# EAGLE design hrd_S2 (EAGLE 7.3.0)
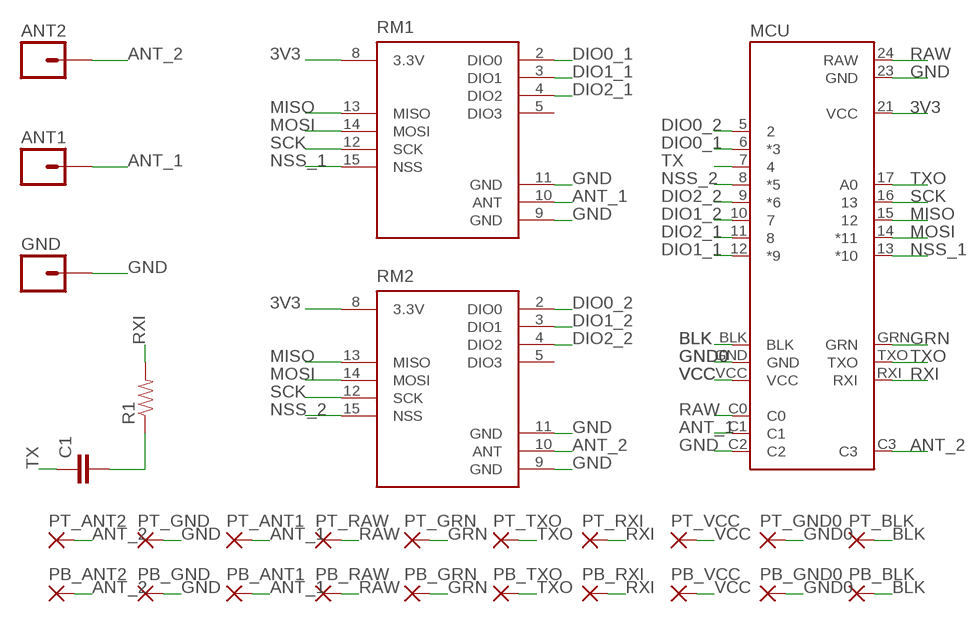
[diagram p0: schematic, sheet 1]

## Parts
ANT1  M01PTH  [1X01]
ANT2  M01PTH  [1X01]
C1  CAP0805  [0805]
GND  M01PTH  [1X01]
MCU  APM  [APM]
PB_ANT1  SMD2  [SMDSLOT]
PB_ANT2  SMD2  [SMDSLOT]
PB_BLK  SMD2  [SMDSLOT]
PB_GND  SMD2  [SMDSLOT]
PB_GND0  SMD2  [SMDSLOT]
PB_GRN  SMD2  [SMDSLOT]
PB_RAW  SMD2  [SMDSLOT]
PB_RXI  SMD2  [SMDSLOT]
PB_TXO  SMD2  [SMDSLOT]
PB_VCC  SMD2  [SMDSLOT]
PT_ANT1  SMD2  [SMDSLOT]
PT_ANT2  SMD2  [SMDSLOT]
PT_BLK  SMD2  [SMDSLOT]
PT_GND  SMD2  [SMDSLOT]
PT_GND0  SMD2  [SMDSLOT]
PT_GRN  SMD2  [SMDSLOT]
PT_RAW  SMD2  [SMDSLOT]
PT_RXI  SMD2  [SMDSLOT]
PT_TXO  SMD2  [SMDSLOT]
PT_VCC  SMD2  [SMDSLOT]
R1  RESISTOR0805-RES  [0805]
RM1  RFM69HW  [RFM69W-XXXS2]
RM2  RFM69HW  [RFM69W-XXXS2]

## Nets
3V3: MCU.21(VCC) RM1.8(3.3V) RM2.8(3.3V)
ANT_1: ANT1.1 MCU.C1 PB_ANT1.1(P) PT_ANT1.1(P) RM1.10(ANT)
ANT_2: ANT2.1 MCU.C3 PB_ANT2.1(P) PT_ANT2.1(P) RM2.10(ANT)
BLK: MCU.BLK PB_BLK.1(P) PT_BLK.1(P)
DIO0_1: MCU.6(*3) RM1.2(DIO0)
DIO0_2: MCU.5 RM2.2(DIO0)
DIO1_1: MCU.12(*9) RM1.3(DIO1)
DIO1_2: MCU.10 RM2.3(DIO1)
DIO2_1: MCU.11 RM1.4(DIO2)
DIO2_2: MCU.9(*6) RM2.4(DIO2)
GND: GND.1 MCU.23(GND) MCU.C2 PB_GND.1(P) PT_GND.1(P) RM1.9(GND) RM1.11(GND) RM2.9(GND) RM2.11(GND)
GND0: MCU.GND PB_GND0.1(P) PT_GND0.1(P)
GRN: MCU.GRN PB_GRN.1(P) PT_GRN.1(P)
MISO: MCU.15 RM1.13(MISO) RM2.13(MISO)
MOSI: MCU.14(*11) RM1.14(MOSI) RM2.14(MOSI)
N$1: C1.2 R1.1
NSS_1: MCU.13(*10) RM1.15(NSS)
NSS_2: MCU.8(*5) RM2.15(NSS)
RAW: MCU.24(RAW) MCU.C0 PB_RAW.1(P) PT_RAW.1(P)
RXI: MCU.RXI PB_RXI.1(P) PT_RXI.1(P) R1.2
SCK: MCU.16 RM1.12(SCK) RM2.12(SCK)
TX: C1.1 MCU.7
TXO: MCU.17(A0) MCU.TXO PB_TXO.1(P) PT_TXO.1(P)
VCC: MCU.VCC PB_VCC.1(P) PT_VCC.1(P)
Unconnected: RM1.5(DIO3) RM2.5(DIO3)

## Library data of the parts
ANT1 ANT2 GND = SparkFun-Connectors:M01: Header 1 Standard 1-pin 0.1" header. Use with straight break away headers (SKU : PRT-00116), right angle break away headers (PRT-00553), swiss pins (PRT-00743), machine pins (PRT-00117), and female headers (PRT-00115).
C1 = SparkFun-Capacitors:CAP: Capacitor Standard 0603 ceramic capacitor, and 0.1" leaded capacitor.
MCU = SparkFun-Boards:APM
PB_ANT1 PB_ANT2 PB_BLK PB_GND PB_GND0 PB_GRN PB_RAW PB_RXI PB_TXO PB_VCC PT_ANT1 PT_ANT2 PT_BLK PT_GND PT_GND0 PT_GRN PT_RAW PT_RXI PT_TXO PT_VCC = wirepad:SMD2: SMD PAD
R1 = SparkFun-Resistors:RESISTOR: Resistor Basic schematic elements and footprints for 0603, 1206, and PTH resistors.
RM1 RM2 = SparkFun-RF:RFM69H

## Net classes
0 default: clearance 0.205 mm

## Board
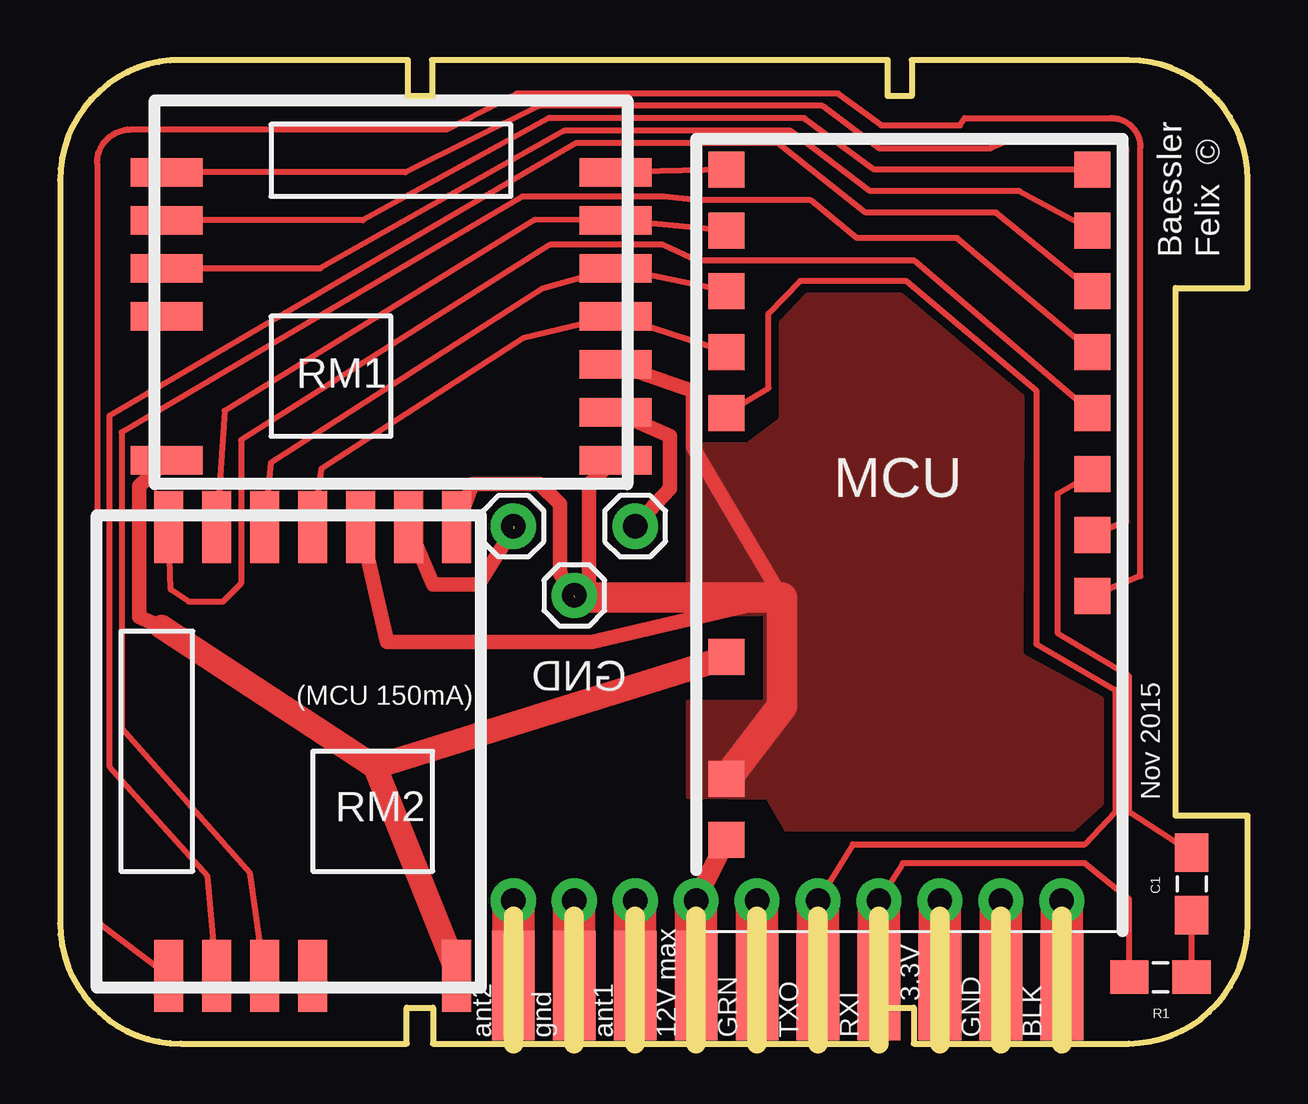
[diagram p1: board, top side]
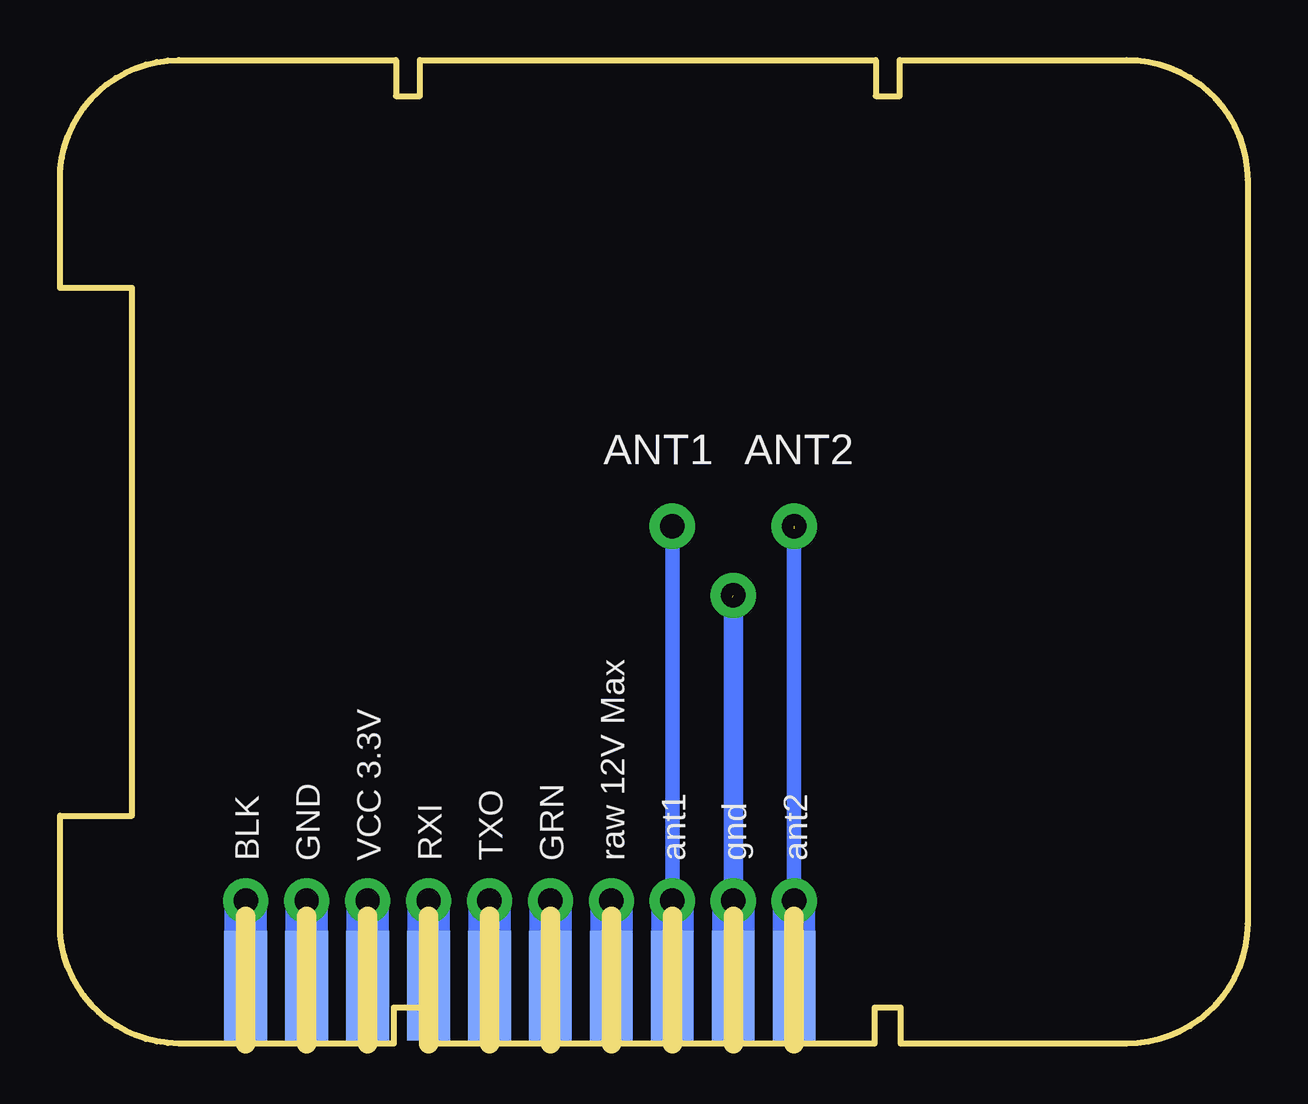
[diagram p2: board, bottom side, seen from below]

Size 49.5 x 41 mm. Coordinates in mm from the lower left corner, seen from the top.
Outline: 18.9,0 15.54,0 15.54,1.5 14.45,1.5 14.45,0 5.05,0 arc-90 0,5 0,36 arc-90 5.05,41 14.5,41 14.5,39.5 15.5,39.5 15.5,41 34.5,41 34.5,39.5 35.5,39.5 35.5,41 44.55,41 arc-90 49.5,36 49.5,31.5 46.5,31.5 46.5,9.5 49.5,9.5 49.5,5 arc-90 44.55,0 41.76,0
Outline: 18.9,0 21.44,0
Outline: 21.44,0 23.98,0
Outline: 23.98,0 26.52,0
Outline: 26.52,0 29.06,0
Outline: 29.06,0 31.6,0
Outline: 31.6,0 34.14,0 34.14,1.5
Outline: 34.14,1.5 35.58,1.5 35.58,0 36.68,0
Outline: 36.68,0 39.22,0
Outline: 39.22,0 41.76,0
Outline: 41.76,0 41.76,5.3
Outline: 39.22,0 39.22,5.3
Outline: 36.68,0 36.68,5.3
Outline: 34.14,1.5 34.14,5.3
Outline: 31.6,0 31.6,5.3
Outline: 29.06,0 29.06,5.3
Outline: 26.52,0 26.52,5.3
Outline: 23.98,0 23.98,5.3
Outline: 21.44,0 21.44,5.3
Outline: 18.9,0 18.9,5.3
Copper layers (1*16): Top 0.035mm / dielectric 1.5mm / Bottom 0.035mm
Design rules "ITEADstudio_DRC": minimum track width 6mil, minimum drill 12mil, track to track 6mil, track to pad 6mil, pad to pad 6mil, via to via 6mil, smd to smd 0mil, copper to edge 10mil, drill to drill 10mil, minimum pad ring 10mil, minimum via ring 6mil, stop-mask expansion 2mil, vias tented up to drill 100mil, thermal gap 10mil

### Footprints (pad centres in the part's own frame; a part is rotated, then mirrored left to right if it is on the bottom)
1X01 = drill 1.016 pad 1.88: 1 0,0
0805 = smd 1.6 x 1.4: 1 -1.3,0; 2 1.3,0
APM = smd 1.5 x 1.5: 5 -7.62,2.54; 6 -7.62,0; 7 -7.62,-2.54; 8 -7.62,-5.08; 9 -7.62,-7.62; 10 -7.62,-10.16; 11 -7.62,-12.7; 12 -7.62,-15.24; 13 7.62,-15.24; 14 7.62,-12.7; 15 7.62,-10.16; 16 7.62,-7.62; 17 7.62,-5.08; 21 7.62,5.08; 23 7.62,10.16; 24 7.62,12.7 | drill 1.016 pad 1.88: BLK -6.35,15.24; C0 8.89,15.24; C1 11.43,15.24; C2 13.97,15.24; C3 16.51,15.24; GND -3.81,15.24; GRN 6.35,15.24; RXI 1.27,15.24; TXO 3.81,15.24; VCC -1.27,15.24
SMDSLOT = smd 1.778 x 4.572: 1 0,0
RFM69W-XXXS2 = smd 3 x 1.2: 2 -9.35,5; 3 -9.35,3; 4 -9.35,1; 5 -9.35,-1; 8 -9.35,-7; 9 9.35,-7; 10 9.35,-5; 11 9.35,-3; 12 9.35,-1; 13 9.35,1; 14 9.35,3; 15 9.35,5

### Placement (x,y rotation side)
ANT1  23.98,21.56 0 top
ANT2  18.9,21.56 0 top
C1  47.17,6.65 270 top
GND  21.44,18.68 0 top
MCU  35.41,21.2 180 top
PB_ANT1  23.98,2.41 0 bottom
PB_ANT2  18.9,2.41 0 bottom
PB_BLK  41.76,2.41 0 bottom
PB_GND  21.44,2.41 0 bottom
PB_GND0  39.22,2.41 0 bottom
PB_GRN  29.06,2.41 0 bottom
PB_RAW  26.52,2.41 0 bottom
PB_RXI  34.14,2.41 0 bottom
PB_TXO  31.6,2.41 0 bottom
PB_VCC  36.68,2.41 0 bottom
PT_ANT1  23.98,2.41 0 top
PT_ANT2  18.9,2.41 0 top
PT_BLK  41.76,2.41 0 top
PT_GND  21.44,2.41 0 top
PT_GND0  39.22,2.41 0 top
PT_GRN  29.06,2.41 0 top
PT_RAW  26.52,2.41 0 top
PT_RXI  34.14,2.41 0 top
PT_TXO  31.6,2.41 0 top
PT_VCC  36.68,2.41 0 top
R1  45.87,2.77 180 top
RM1  13.8,31.32 0 top
RM2  9.54,12.18 90 top

### Tracks (layer width: path | path; a pad name or v marks a point on that pad's centre or on a via)
3V3
  Top 0.61: RM1.8 3.3,23.24 3.3,17.78 4.24,17.37
  Top 0.813: MCU.21 arc-90 27.78,16.1 | RM2.8 arc90 16.59,2.88
  Top 1.016: 13.13,11.53 4.24,17.37 | 16.59,2.88 13.13,11.53 | 27.78,16.1 13.13,11.53
ANT_1
  Top 0.61: ANT1.1 25.43,23.14 25.43,25.32 RM1.10
  Top 1.778: MCU.C1 PB_ANT1.1
  Bottom 0.61: ANT1.1 MCU.C1
  Bottom 1.778: PB_ANT1.1 MCU.C1
ANT_2  (1 unrouted)
  Top 0.61: RM2.10 15.54,19.13 17.45,19.13 18.9,21.46
  Top 1.778: MCU.C3 PB_ANT2.1
  Bottom 0.61: MCU.C3 ANT2.1
  Bottom 1.778: PB_ANT2.1 MCU.C3
BLK
  Top 1.778: MCU.BLK PB_BLK.1
  Bottom 1.778: PB_BLK.1 MCU.BLK
DIO0_1
  Top 0.254: RM1.2 14.4,36.31 19.99,39.09 31.78,39.09 34.14,37.31 38.78,37.31 39.83,37.77 43.81,37.77 arc-90 44.45,37.24 44.45,21.77 MCU.6
DIO0_2
  Top 0.254: RM2.2 1.55,5.08 1.55,36.7 arc-90 2.95,38.1 16.13,38.1 19.05,39.6 32.43,39.6 34.24,38.28 37.52,38.28 37.72,38.58 43.81,38.58 arc-90 45.03,37.36 45.03,19.48 MCU.5
DIO1_1
  Top 0.254: MCU.12 33.93,36.44 31.01,38.58 20.37,38.58 12.62,34.31 RM1.3
DIO1_2
  Top 0.254: RM2.3 6.15,6.99 2.06,11.56 2.06,26.16 21.51,37.54 29.92,37.54 33.58,34.65 39.01,34.65 MCU.10
DIO2_1
  Top 0.254: RM1.4 10.85,32.31 21,38.05 30.45,38.05 33.76,35.53 39.98,35.53 MCU.11
DIO2_2
  Top 0.254: RM2.4 7.92,7.11 2.56,13.16 2.56,25.48 19.28,35.31 25.17,35.31 26.54,35.15 31.29,35.15 33.22,33.58 37.39,33.58 MCU.9
GND  (1 unrouted)
  Top 0.61: RM2.9 17.2,23.32 19.99,23.32 20.85,22.49 20.85,19.58 GND.1 22.05,19.07 | RM1.9 22.05,23.34 22.05,19.07 | RM2.11 13.64,16.74 22.17,16.74 30.1,18.59 26.39,24.87 26.39,27.2 RM1.11 | 22.05,19.07 21.56,18.62
  Top 1.27: 21.46,18.59 30.1,18.59 30.1,14.05 MCU.23
  Top 1.778: MCU.C2 PB_GND.1
  Bottom 0.813: MCU.C2 GND.1
  Bottom 1.778: PB_GND.1 MCU.C2
  pour Top (no thermals): 26.21,10.31 26.21,14.22 29.44,14.22 29.44,17.93 26.21,17.93 26.21,24.94 28.68,24.94 30.1,26.01 30.1,30.07 31.16,31.19 35.03,31.19 40.08,26.97 40.03,16.21 43.38,14.38 43.38,10.01 42.21,8.94 30.3,8.94 29.54,10.26
GND0
  Top 1.778: MCU.GND PB_GND0.1
  Bottom 1.778: PB_GND0.1 MCU.GND
GRN
  Top 1.778: PB_GRN.1 MCU.GRN
  Bottom 1.778: PB_GRN.1 MCU.GRN
MISO
  Top 0.254: MCU.15 RM1.13 20.12,31.47 8.79,24.21 RM2.13
MOSI
  Top 0.254: MCU.14 RM1.14 19.81,34.34 6.86,26.36 RM2.14
N$1
  Top 0.254: R1.1 C1.2
NSS_1
  Top 0.254: MCU.13 RM1.15
NSS_2
  Top 0.254: RM2.15 4.62,18.92 5.38,18.41 6.78,18.41 7.54,19.18 7.54,25.15 20.42,33.3 25.14,33.3 26.57,32.64 35.61,32.64 MCU.8
RAW
  Top 0.813: MCU.24 MCU.C0
  Top 1.778: PB_RAW.1 MCU.C0
  Bottom 1.778: PB_RAW.1 MCU.C0
RXI
  Top 0.254: MCU.RXI 35.13,7.52 42.72,7.52 44.57,6.02 R1.2
  Top 1.778: PB_RXI.1 MCU.RXI
  Bottom 1.778: PB_RXI.1 MCU.RXI
SCK
  Top 0.254: MCU.16 RM1.12 19.33,29.41 10.9,23.95 RM2.12
TX
  Top 0.254: MCU.7 41.58,22.91 41.58,17.12 44.55,15.34 44.55,9.65 C1.1
TXO
  Top 0.254: MCU.17 29.54,27.33 29.54,30.43 30.86,31.8 35.25,31.8 40.69,27.23 40.69,16.66 43.99,14.73 43.99,9.65 42.72,8.31 33.04,8.31 MCU.TXO
  Top 1.778: PB_TXO.1 MCU.TXO
  Bottom 1.778: PB_TXO.1 MCU.TXO
VCC
  Top 1.778: PB_VCC.1 MCU.VCC
  Bottom 1.778: PB_VCC.1 MCU.VCC

### Text on the board
tPlace: Baessler | Felix © | (MCU 150mA) | Nov 2015 | 3.3V | ant2 | gnd | ant1 | 12V max | GRN | TXO | RXI | GND | BLK
bPlace: ant2 | gnd | ant1 | raw 12V Max | GRN | TXO | RXI | VCC 3.3V | GND | BLK